# EasyEDA Pro project CH32V307VCT6开源最小系统.eprj, schematic Schematic1
Create Date: 2023-05-18; Page Name: P1; Project Name: CH32V307VCT6最小系统; Schematic Name: Schematic1; Update Date: 2023-06-06; Company: 嘉立创EDA; Page Size: A4; Version: V1.0
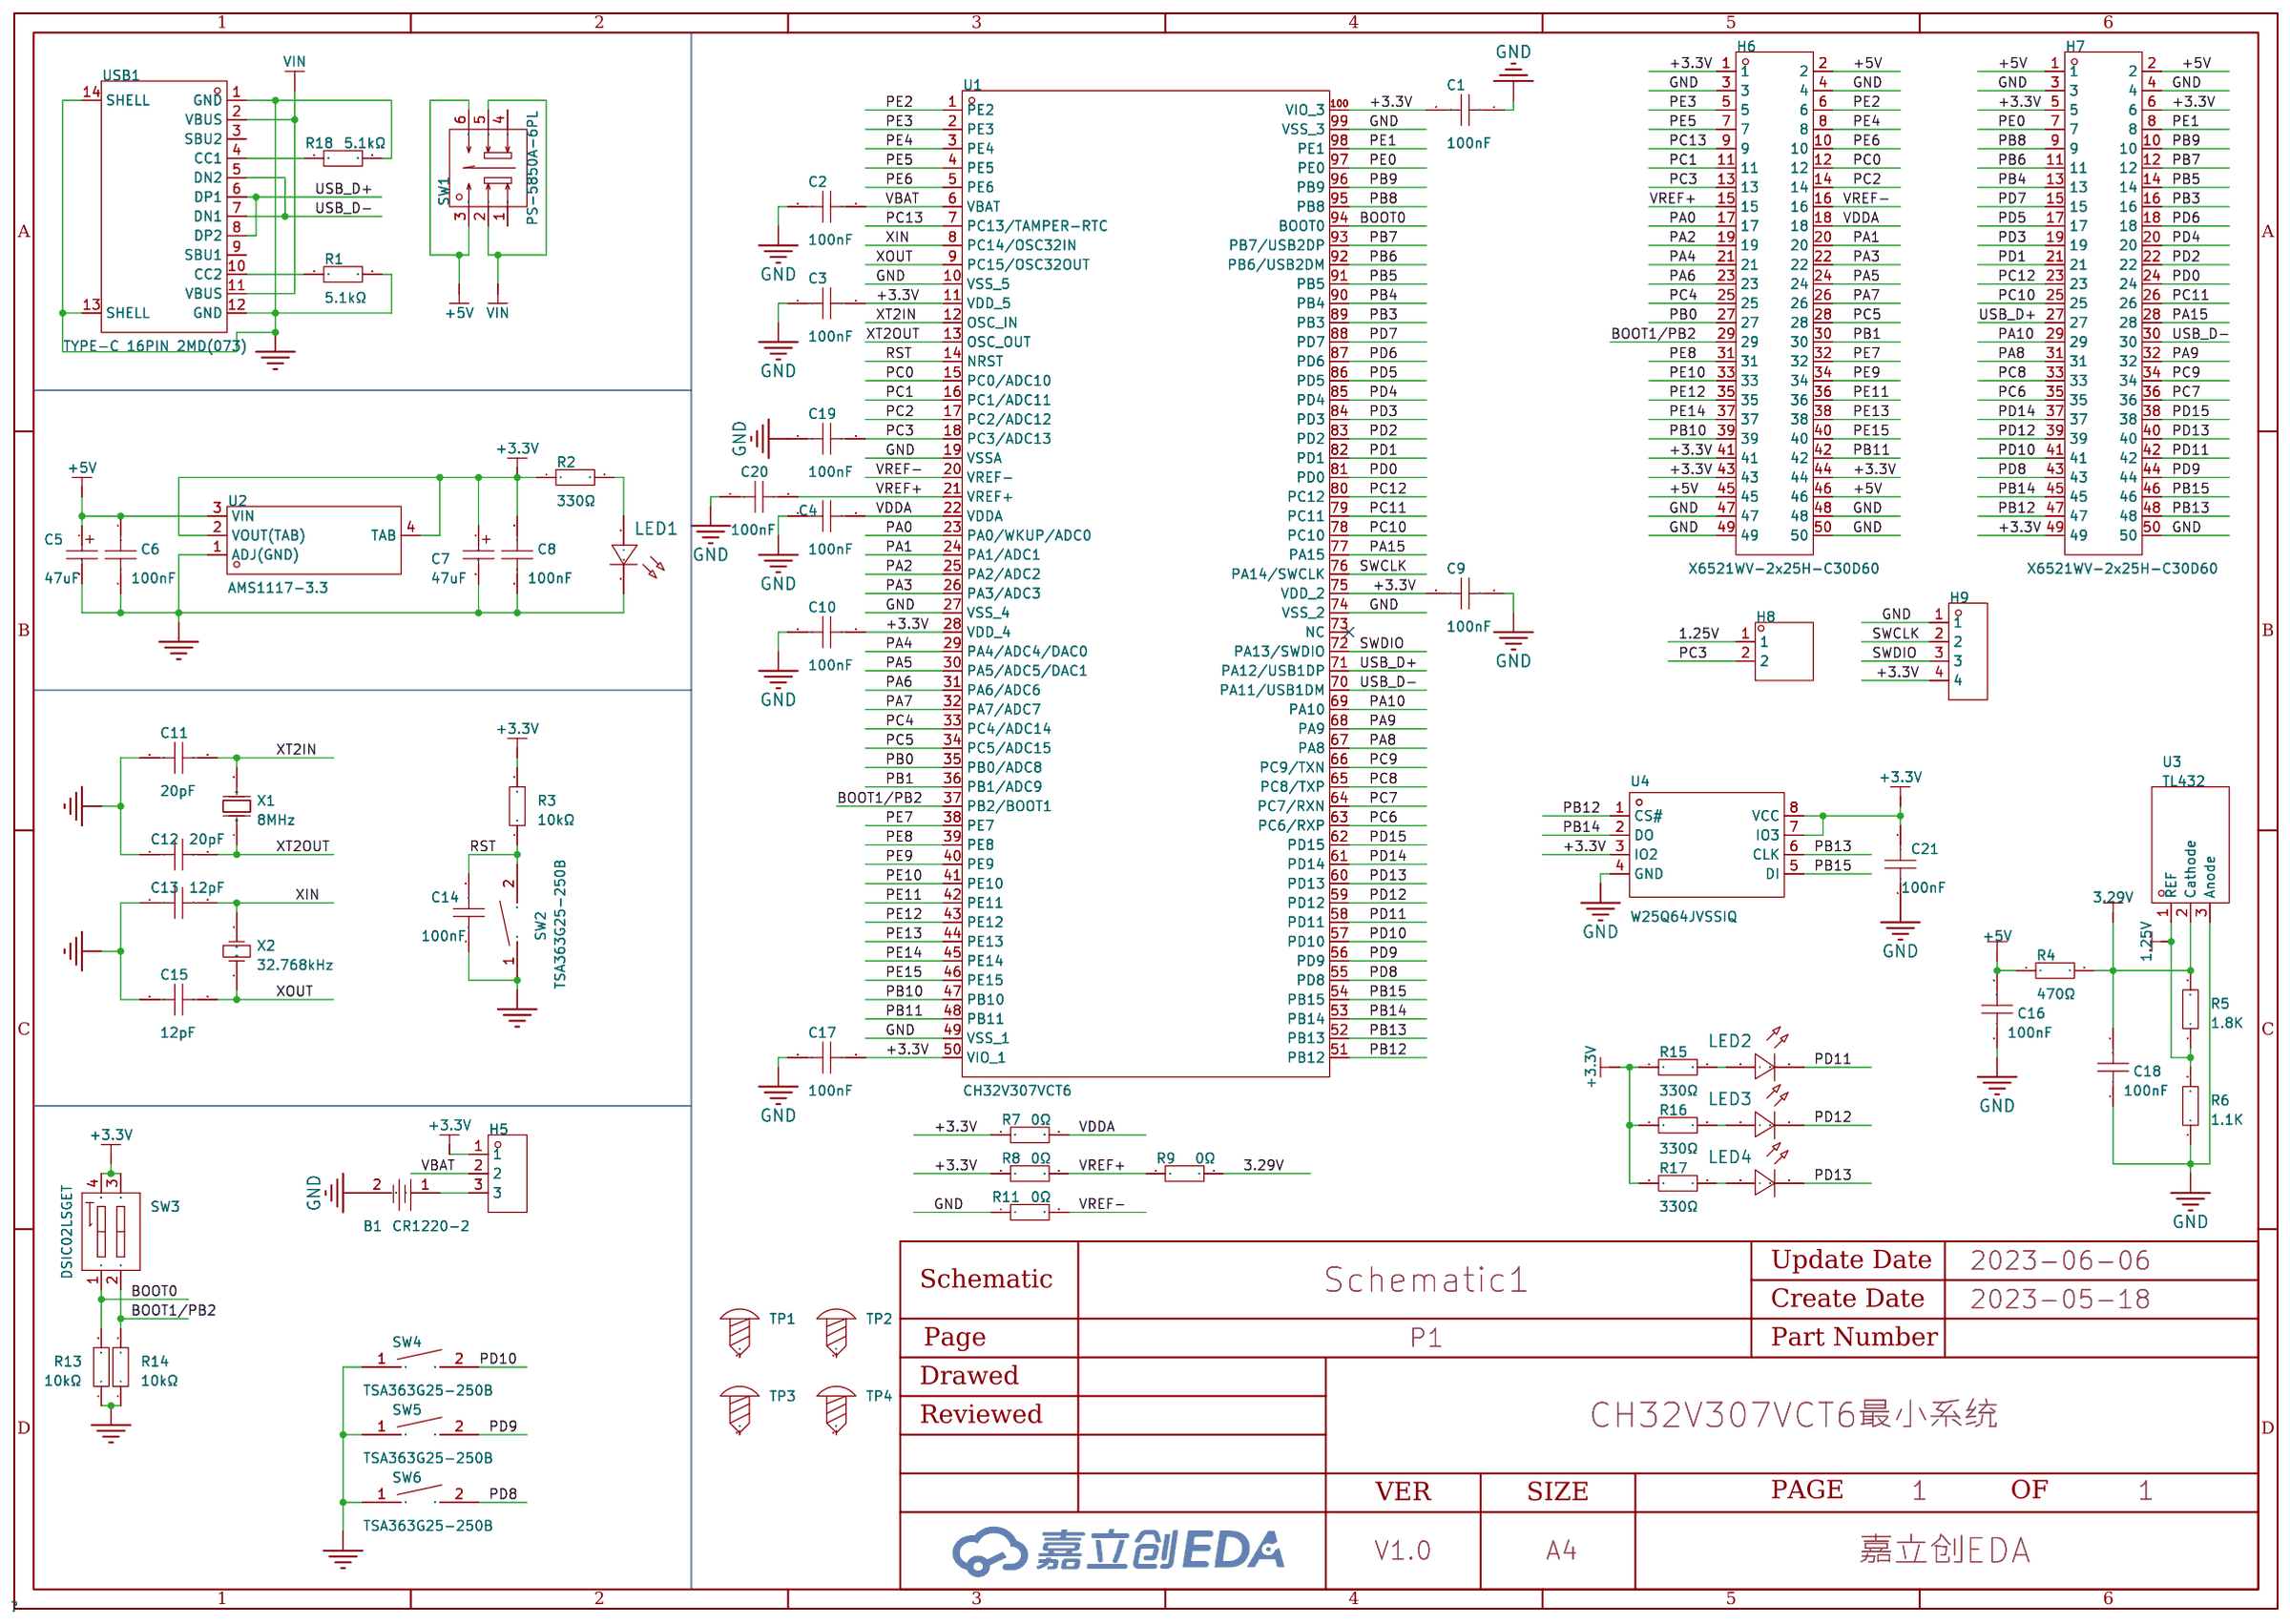
[diagram p0: schematic sheet]

## Parts
B1  CR1220-2  [BAT-SMD_CR1220-2]
C1  100nF  [C0805]
C2  100nF  [C0805]
C3  100nF  [C0805]
C4  100nF  [C0805]
C5  47uF  [CASE-B_3528]
C6  100nF  [C0805]
C7  47uF  [CASE-B_3528]
C8  100nF  [C0805]
C9  100nF  [C0805]
C10  100nF  [C0805]
C11  20pF  [C0805]
C12  20pF  [C0805]
C13  12pF  [C0805]
C14  100nF  [C0805]
C15  12pF  [C0805]
C16  100nF  [C0805]
C17  100nF  [C0805]
C18  100nF  [C0805]
C19  100nF  [C0805]
C20  100nF  [C0805]
C21  100nF  [C0805]
H5  -  [HDR-TH_3P-P2.54-V-M]
H6  X6521WV-2x25H-C30D60  [HDR-TH_50P-2.54-V-M-R2-C25-S2.54]
H7  X6521WV-2x25H-C30D60  [HDR-TH_50P-2.54-V-M-R2-C25-S2.54]
H8  -  [HDR-TH_2P-P2.54-V-M-1]
H9  -  [HDR-TH_4P-P2.54-V-M]
LED1  NCD0805R1  [LED_0805]
LED2  NCD0805R1  [LED_0805]
LED3  NCD0805R1  [LED_0805]
LED4  NCD0805R1  [LED_0805]
R1  5.1kΩ  [R0805]
R2  330Ω  [R0805]
R3  10kΩ  [R0805]
R4  470Ω  [R0805]
R5  1.8K  [R0805]
R6  1.1K  [R0805]
R7  0Ω  [R0805]
R8  0Ω  [R0805]
R9  0Ω  [R0805]
R11  0Ω  [R0805]
R13  10kΩ  [R0805]
R14  10kΩ  [R0805]
R15  330Ω  [R0805]
R16  330Ω  [R0805]
R17  330Ω  [R0805]
R18  5.1kΩ  [R0805]
SW1  PS-5850A-6PL  [SW-TH_6P-L5.8-W5.8-P2.00-LS4.5-BL]
SW2  TSA363G25-250B  [SW-SMD_L6.1-W3.6-LS8.0]
SW3  DSIC02LSGET  [SW-SMD_4P-L6.0-W5.1-P2.54-LS9.3-BL]
SW4  TSA363G25-250B  [SW-SMD_L6.1-W3.6-LS8.0]
SW5  TSA363G25-250B  [SW-SMD_L6.1-W3.6-LS8.0]
SW6  TSA363G25-250B  [SW-SMD_L6.1-W3.6-LS8.0]
TP1  -  [M3螺丝]
TP2  -  [M3螺丝]
TP3  -  [M3螺丝]
TP4  -  [M3螺丝]
U1  CH32V307VCT6  [LQFP-100_L14.0-W14.0-P0.50-LS16.0-BL]
U2  AMS1117-3.3  [SOT-223-4_L6.5-W3.5-P2.30-LS7.0-BR]
U3  TL432  [SOT-23-3_L2.9-W1.3-P1.90-LS2.4-BR]
U4  W25Q64JVSSIQ  [SOP-8_L5.3-W5.3-P1.27-LS8.0-BL]
USB1  TYPE-C 16PIN 2MD(073)  [USB-C-SMD_TYPE-C-6PIN-2MD-073]
X1  8MHz  [CRYSTAL-SMD_L5.0-W3.2]
X2  32.768kHz  [OSC-TH_BD3.1-P0.8-D0.3]

## Library data of the parts
B1 = CR1220-2: 连接器类型:电池底座;适用电池规格:CR1220;工作温度范围:-;; LCSC Part Name: 电池底座 适用电池:CR1220; Supplier Part: C70381; Manufacturer: Q&J; Supplier Footprint: SMD; JLCPCB Part Class: Extended Part; Datasheet: https://atta.szlcsc.com/upload/public/pdf/source/20160427/1461725216696.pdf; Supplier: LCSC; Connector Type: 电池底座; Battery Type: CR1220
C1-C4 C9 C10 C16-C21 = CAP_0805: Supplier Footprint: 0805
C5 C7 = TAJB476K010RNJ: 容值:47uF;精度:±10%;额定电压:10V;等效串联电阻:1Ω@100kHz;工作温度:-55℃~+125℃;; LCSC Part Name: 47uF ±10% 10V; Supplier Part: C22036; Manufacturer: Kyocera AVX; Supplier Footprint: CASE-B-3528; JLCPCB Part Class: Extended Part; Datasheet: https://atta.szlcsc.com/upload/public/pdf/source/20160107/1457707745567.pdf; Supplier: LCSC; Tolerance: ±10%; Rated Voltage: 10V; Equivalent Series Resistance(ESR): 1Ω@100kHz; Operating Temperature: -55℃~+125℃
C6 C8 C14 = CL21B104KBCNNNC: 容值:100nF;精度:±10%;额定电压:50V;材质(温度系数):X7R;; LCSC Part Name: 100nF ±10% 50V; Supplier Part: C1711; Manufacturer: SAMSUNG(三星); Supplier Footprint: 0805; JLCPCB Part Class: Extended Part; Datasheet: https://atta.szlcsc.com/upload/public/pdf/source/20160103/1457707693305.pdf; Supplier: LCSC; Tolerance: ±10%; Voltage Rated: 50V; Temperature Coefficient: X7R
C11 C12 = 0805CG200J500NT: 容值:20pF;精度:±5%;额定电压:50V;材质(温度系数):C0G;; LCSC Part Name: 20pF ±5% 50V; Supplier Part: C94472; Manufacturer: FH(风华); Supplier Footprint: 0805; JLCPCB Part Class: Extended Part; Datasheet: https://atta.szlcsc.com/upload/public/pdf/source/20170923/C94472_1506149578159988997.pdf; Supplier: LCSC; Tolerance: ±5%; Voltage Rated: 50V; Temperature Coefficient: C0G
C13 C15 = 0805CG120J500NT: 容值:12pF;精度:±5%;额定电压:50V;材质(温度系数):C0G;; LCSC Part Name: 12pF ±5% 50V; Supplier Part: C1792; Manufacturer: FH(风华); Supplier Footprint: 0805; JLCPCB Part Class: Basic Part; Datasheet: https://atta.szlcsc.com/upload/public/pdf/source/20170923/C1792_1506149354360988551.pdf; Supplier: LCSC; Tolerance: ±5%; Voltage Rated: 50V; Temperature Coefficient: C0G
H5 = HDR-M_2.54_1x3P: Supplier Part: C2937625; Supplier Footprint: 插件
H6 H7 = X6521WV-2x25H-C30D60: 排数:双排;总PIN位数:50;间距:2.54mm;插针结构:2x25P;行距:2.54mm;安装类型:直插;圆针/方针:方针;额定电流:3A;额定电压:250V;配合针长度:6mm;塑高:2.5mm;端接针长度:3mm;触头材质:黄铜;触头镀层:金;工作温度范围:-40℃~+105℃;焊接温度(最大值):260℃;颜色:黑色;; LCSC Part Name: 2.54mm 2x25P 直插 方针; Supplier Part: C725897; Manufacturer: XKB Connectivity(中国星坤); Supplier Footprint: 插件,P=2.54mm; JLCPCB Part Class: Extended Part; Datasheet: https://atta.szlcsc.com/upload/public/pdf/source/20211009/DE33EBA4104B5B447A7BD8383FBBA145.pdf; Supplier: LCSC; Number of Rows: 双排; Number of Pins: 50; Pitch: 2.54mm; Pin Structure: 2x25P; Row Spacing: 2.54mm; Mounting Type: 直插; Circluar Pins/Square Pins: 方针; Current Rating (Max): 3A; Voltage Rating (Max): 250V; Length of Mating Pin: 6mm; Insulation Height: 2.5mm; Length of End Connection Pin: 3mm; Contact Material: 黄铜; Contact Plating: 金; Operating Temperature Range: -40℃~+105℃; Welding Temperature (Max): 260℃; Color: 黑色
H8 = HDR-M_2.54_1x2P: Supplier Part: C124375; Supplier Footprint: 插件
H9 = HDR-M_2.54_1x4P: Supplier Part: C492403; Supplier Footprint: 插件
LED1-LED4 = NCD0805R1: 发光颜色:红灯;; LCSC Part Name: 红灯; Supplier Part: C84256; Manufacturer: 国星光电; Supplier Footprint: 0805; JLCPCB Part Class: Basic Part; Datasheet: https://atta.szlcsc.com/upload/public/pdf/source/20200820/C84256_F0A75A43B3EAD75808600A0514C76B99.pdf; Supplier: LCSC; Emitted Color: 红灯
R1 R18 = 0805W8F5101T5E: 电阻类型:厚膜电阻;阻值:5.1kΩ;精度:±1%;功率:125mW;; LCSC Part Name: 5.1kΩ ±1% 125mW; Supplier Part: C27834; Manufacturer: UNI-ROYAL(厚声); Supplier Footprint: 0805; JLCPCB Part Class: Basic Part; Datasheet: https://atta.szlcsc.com/upload/public/pdf/source/20200306/C422600_1E6D84923E4A46A82E41ADD87F860B5C.pdf; Supplier: LCSC; Type: 厚膜电阻; Tolerance: ±1%; Power(Watts): 125mW; Temperature Coefficient: ±100ppm/℃; Overload Voltage (Max): 150V; Operating Temperature Range: -55℃~+155℃
R2 R4-R9 R11 R15-R17 = Res_0805: Supplier Footprint: 0805
R3 R13 R14 = 0805W8F1002T5E_C17414: 电阻类型:厚膜电阻;阻值:10kΩ;精度:±1%;功率:125mW;; LCSC Part Name: 10kΩ ±1% 125mW; Supplier Part: C17414; Manufacturer: UNI-ROYAL(厚声); Manufacturer Part: 0805W8F1002T5E; Supplier Footprint: 0805; JLCPCB Part Class: Basic Part; Datasheet: https://atta.szlcsc.com/upload/public/pdf/source/20200306/C422600_1E6D84923E4A46A82E41ADD87F860B5C.pdf; Supplier: LCSC; Type: 厚膜电阻; Tolerance: ±1%; Power(Watts): 125mW; Temperature Coefficient: ±100ppm/℃; Overload Voltage (Max): 150V; Operating Temperature Range: -55℃~+155℃
SW1 = PS-5850A-6PL: 5.8自锁按键开关 高头 耐高温; LCSC Part Name: 自锁按键开关; Supplier Part: C963201; Manufacturer: G-Switch(品赞); Supplier Footprint: 插件,5.8x5.8x10mm; JLCPCB Part Class: Extended Part; Datasheet: https://atta.szlcsc.com/upload/public/pdf/source/20201201/C963201_9229C247AC907A82E381B4EE0BC1DEDE.pdf; Supplier: LCSC
SW2 SW4-SW6 = TSA363G25-250B: 触点电流:50mA;额定电压(DC):12V;电路结构:单刀单掷;按钮作用方向:顶部触动;致动器样式:矩形按钮;照明颜色:-;开关长度:6.05mm;开关宽度:3.6mm;开关高度:2.5mm;; LCSC Part Name: 3*6*2.5  白柄贴片  250gf; Supplier Part: C354943; Manufacturer: BRIGHT(博瑞泰); Supplier Footprint: SMD; JLCPCB Part Class: Extended Part; Datasheet: https://atta.szlcsc.com/upload/public/pdf/source/20190426/C354943_F8D02988919B0D3B4D493E3C3D798834.pdf; Supplier: LCSC; Contact Current: 50mA; Voltage Rating (DC): 12V; Circuit: 单刀单掷; Actuator Orientation: 顶部触动; Actuator Style: 矩形按钮; Switch Length: 6.05mm; Switch Width: 3.6mm; Switch Height: 2.5mm
SW3 = DSIC02LSGET: 类型:平拨，凸起式;电路结构:单刀单掷;开关位数:2;引脚间距:2.54mm;颜色:黑色;; LCSC Part Name: 2.54mm 2位高推 拨码开关; Supplier Part: C54949; Manufacturer: YE; Supplier Footprint: SMD-4P,6x5.08mm; JLCPCB Part Class: Extended Part; Datasheet: https://atta.szlcsc.com/upload/public/pdf/source/20150928/1457707425489.pdf; Supplier: LCSC; Type: 平拨，凸起式; Circuit: 单刀单掷; Number of Positions: 2; Lead Pitch: 2.54mm; Color: 黑色
TP1-TP4 = M3螺丝: Supplier Footprint: 插件
U1 = CH32V307VCT6: CPU内核:RISC-V;CPU最大主频:144MHz;工作电压范围:2.5V~3.3V;内部振荡器:有;外部时钟频率范围:3MHz~25MHz;程序 FLASH容量:256KB;RAM总容量:64KB;EEPROM/数据 FLASH容量:-;GPIO端口数量:80;ADC(单元数/通道数/位数):2@x16ch/12bit;DAC(单元数/通道数/位数):2@x2ch/12bit;(E)PWM(单元数/通道数/位数):8@x32ch/16bit;8位Timer数量:-;16位Timer数量:10;32位; LCSC Part Name: RISC-V 144MHz 闪存：256KB RAM：64KB; Supplier Part: C2943979; Manufacturer: WCH(南京沁恒); Supplier Footprint: LQFP-100(14x14); JLCPCB Part Class: Extended Part; Datasheet: https://atta.szlcsc.com/upload/public/pdf/source/20220111/249074F152243A2E6E0364BFD3BF5289.pdf; Supplier: LCSC; CPU Core: RISC-V; Maximum Frequency: 144MHz; Supply Voltage Range: 2.5V~3.3V; Internal Oscillator: 有; External Clock Frequency Rang: 3MHz~25MHz; Program FLASH Size: 256KB; RAM Size: 64KB; GPIO Ports Number: 80; ADC (Units/Channels/bits): 2@x16ch/12bit; DAC (Units/Channels/bits): 2@x2ch/12bit; (E)PWM (Units/Channels/bits): 8@x32ch/16bit; 16Bit Timer Number: 10; CMP Number: 4; U(S)ART Number: 8; I2C Number: 2; I2S Number: 2; (Q)SPI Number: 3; CAN Number: 2; Operating Temperature Range: -40℃~+85℃
U2 = AMS1117-3.3_C347222: 输出类型:固定;输出极性:正;输出通道数:1;最大输入电压:18V;输出电压:3.3V;压差:1.3V@(1A);输出电流:1A;电源纹波抑制比(PSRR):60dB@(120Hz);; LCSC Part Name: 正 Vin=18V Vout=3.3V 1A 60dB@(120Hz); Supplier Part: C347222; Manufacturer: UMW(广东友台半导体); Supplier Footprint: SOT-223-4; JLCPCB Part Class: Extended Part; Datasheet: https://atta.szlcsc.com/upload/public/pdf/source/20211011/50CC665C22E3A66C08379A4A74BDA25C.pdf; Supplier: LCSC; Output Type: 固定; Output Polarity: 正; Number of Outputs: 1; Maximum Input Voltage: 18V; Output Voltage: 3.3V; Dropout Voltage: 1.3V@(1A); Output Current: 1A; Power Supply Rejection Ratio (PSRR): 60dB@(120Hz)
U3 = TL432_C5184435: 电压基准类型:-;输出类型:可调;输入电压:-;输出电压:1.25V~18V;输出电流:100mA;精度:±1%;温度系数:-;静态电流:-;最小阴极电流调节:-;噪声(0.1Hz-10Hz):-;噪声(10Hz-10kHz):-;动态阻抗:-;工作温度:0℃~+70℃@(Ta);; LCSC Part Name: 1.25V~18V 100mA; Supplier Part: C5184435; Manufacturer: HXY MOSFET(华轩阳电子); Supplier Footprint: SOT-23; Datasheet: https://atta.szlcsc.com/upload/public/pdf/source/20220926/BC9BA250DBB97364FC1F59E1FEEBCD78.pdf; Supplier: LCSC; Output Type: 可调; Output Voltage: 1.25V~18V; Output Current: 100mA; Tolerance: ±1%; Operating Temperature: 0℃~+70℃@(Ta)
U4 = W25Q64JVSSIQ_C83140: 64M-bit/8M-byte FLASH芯片,SPI接口 133MHz(266/532MHz Dual/Quad-SPI) 比W25Q64FVSSIG更高速度; Supplier Part: C83140; Manufacturer: WINBOND(华邦); Supplier Footprint: SOP-8-208mil; JLCPCB Part Class: Extended Part; Datasheet: https://atta.szlcsc.com/upload/public/pdf/source/20161110/1478742546019.pdf; Supplier: LCSC
USB1 = TYPE-C 16PIN 2MD(073): 连接器类型:Type-C;标准:-;公母:母座;触点数量:16;端口数量:1;安装方式:卧贴;额定电流 - 电源:5A;工作温度范围:-25℃~+85℃;; LCSC Part Name: TYPE-C母座 16P 4脚插件带定位柱 不锈钢外壳 2次模顶; Supplier Part: C2765186; Manufacturer: SHOU HAN(首韩); Supplier Footprint: SMD; JLCPCB Part Class: Extended Part; Datasheet: https://atta.szlcsc.com/upload/public/pdf/source/20211123/39B17C16241EAC15C5E277BDA434118E.pdf; Supplier: LCSC; Connector Type: Type-C; Gender: 母座; Number of Contacts: 16; Number of Ports: 1; Mounting Style: 卧贴; Current Rating - Power (Max): 5A; Operating Temperature Range: -25℃~+85℃
X1 = X50328MSB2GI: 频率:8MHz;频率公差:±10ppm;负载电容:20pF;; LCSC Part Name: 8MHz ±10ppm 20pF YSX530GA; Supplier Part: C115962; Manufacturer: YXC(扬兴晶振); Supplier Footprint: SMD5032-2P; JLCPCB Part Class: Basic Part; Datasheet: https://atta.szlcsc.com/upload/public/pdf/source/20230220/0EBFFB9D6D8CE6A211407822BBB6C516.pdf; Supplier: LCSC; Crystal Type: 贴片无源晶振; Frequency Tolerance: ±10ppm; Frequency Stability: ±50ppm; Load Capacitance: 20pF; Operating Temperature: -40℃~+85℃
X2 = X308032768KGB2SC: 频率:32.768kHz;频率公差:±10ppm;负载电容:12.5pF;; LCSC Part Name: 32.768kHz ±10ppm 12.5pF YT-38; Supplier Part: C52082; Manufacturer: YXC(扬兴晶振); Supplier Footprint: DT-38; JLCPCB Part Class: Extended Part; Datasheet: https://atta.szlcsc.com/upload/public/pdf/source/20210729/394323D37097DADF5DA3ECA9C1DCF4BF.pdf; Supplier: LCSC; Crystal Type: 圆柱体晶振; Frequency Tolerance: ±10ppm; Load Capacitance: 12.5pF; Operating Temperature: -20℃~+70℃

## Nets
1.25V: H8.1 R5.1 R6.2 U3.1(REF)
3.29V: C18.2 R4.2 R5.2 R9.2 U3.2(Cathode)
+3.3V: C1.2 C3.2 C7.1 C8.2 C9.2 C10.2 C17.2 C21.2 H5.1 H6.1 H6.41 H6.43 H6.44 H7.5 H7.6 H7.49 H9.4 R2.1 R3.2 R7.1 R8.1 R15.1 R16.1 R17.1 SW3.3(B2) SW3.4(B1) U1.11(VDD_5) U1.28(VDD_4) U1.50(VIO_1) U1.75(VDD_2) U1.100(VIO_3) U2.2(VOUT(TAB)) U2.4(TAB) U4.3(IO2) U4.7(IO3) U4.8(VCC)
+5V: C5.1 C6.2 C16.2 H6.2 H6.45 H6.46 H7.1 H7.2 R4.1 SW1.3 SW1.6 U2.3(VIN)
GND: B1.2 C1.1 C2.1 C3.1 C4.1 C5.2 C6.1 C7.2 C8.1 C9.1 C10.1 C11.1 C12.1 C13.1 C14.1 C15.1 C16.1 C17.1 C18.1 C19.1 C20.1 C21.1 H6.3 H6.4 H6.47 H6.48 H6.49 H6.50 H7.3 H7.4 H7.50 H9.1 LED1.1(C) R1.2 R6.1 R11.1 R13.1 R14.1 R18.2 SW2.1 SW4.1 SW5.1 SW6.1 U1.10(VSS_5) U1.19(VSSA) U1.27(VSS_4) U1.49(VSS_1) U1.74(VSS_2) U1.99(VSS_3) U2.1(ADJ(GND)) U3.3(Anode) U4.4(GND) USB1.1(GND) USB1.12(GND) USB1.13(SHELL) USB1.14(SHELL)
VBAT: C2.2 H5.2 U1.6(VBAT)
VDDA: C4.2 H6.18 R7.2 U1.22(VDDA)
VIN: SW1.2 SW1.5 USB1.2(VBUS) USB1.11(VBUS)
BOOT0: R13.2 SW3.1(A1) U1.94(BOOT0)
BOOT1/PB2: H6.29 R14.2 SW3.2(A2) U1.37(PB2/BOOT1)
PA0: H6.17 U1.23(PA0/WKUP/ADC0)
PA1: H6.20 U1.24(PA1/ADC1)
PA2: H6.19 U1.25(PA2/ADC2)
PA3: H6.22 U1.26(PA3/ADC3)
PA4: H6.21 U1.29(PA4/ADC4/DAC0)
PA5: H6.24 U1.30(PA5/ADC5/DAC1)
PA6: H6.23 U1.31(PA6/ADC6)
PA7: H6.26 U1.32(PA7/ADC7)
PA8: H7.31 U1.67(PA8)
PA9: H7.32 U1.68(PA9)
PA10: H7.29 U1.69(PA10)
PA15: H7.28 U1.77(PA15)
PB0: H6.27 U1.35(PB0/ADC8)
PB1: H6.30 U1.36(PB1/ADC9)
PB3: H7.16 U1.89(PB3)
PB4: H7.13 U1.90(PB4)
PB5: H7.14 U1.91(PB5)
PB6: H7.11 U1.92(PB6/USB2DM)
PB7: H7.12 U1.93(PB7/USB2DP)
PB8: H7.9 U1.95(PB8)
PB9: H7.10 U1.96(PB9)
PB10: H6.39 U1.47(PB10)
PB11: H6.42 U1.48(PB11)
PB12: H7.47 U1.51(PB12) U4.1(CS#)
PB13: H7.48 U1.52(PB13) U4.6(CLK)
PB14: H7.45 U1.53(PB14) U4.2(DO)
PB15: H7.46 U1.54(PB15) U4.5(DI)
PC0: H6.12 U1.15(PC0/ADC10)
PC1: H6.11 U1.16(PC1/ADC11)
PC2: H6.14 U1.17(PC2/ADC12)
PC3: C19.2 H6.13 H8.2 U1.18(PC3/ADC13)
PC4: H6.25 U1.33(PC4/ADC14)
PC5: H6.28 U1.34(PC5/ADC15)
PC6: H7.35 U1.63(PC6/RXP)
PC7: H7.36 U1.64(PC7/RXN)
PC8: H7.33 U1.65(PC8/TXP)
PC9: H7.34 U1.66(PC9/TXN)
PC10: H7.25 U1.78(PC10)
PC11: H7.26 U1.79(PC11)
PC12: H7.23 U1.80(PC12)
PC13: H6.9 U1.7(PC13/TAMPER-RTC)
PD0: H7.24 U1.81(PD0)
PD1: H7.21 U1.82(PD1)
PD2: H7.22 U1.83(PD2)
PD3: H7.19 U1.84(PD3)
PD4: H7.20 U1.85(PD4)
PD5: H7.17 U1.86(PD5)
PD6: H7.18 U1.87(PD6)
PD7: H7.15 U1.88(PD7)
PD8: H7.43 SW6.2 U1.55(PD8)
PD9: H7.44 SW5.2 U1.56(PD9)
PD10: H7.41 SW4.2 U1.57(PD10)
PD11: H7.42 LED2.1(C) U1.58(PD11)
PD12: H7.39 LED3.1(C) U1.59(PD12)
PD13: H7.40 LED4.1(C) U1.60(PD13)
PD14: H7.37 U1.61(PD14)
PD15: H7.38 U1.62(PD15)
PE0: H7.7 U1.97(PE0)
PE1: H7.8 U1.98(PE1)
PE2: H6.6 U1.1(PE2)
PE3: H6.5 U1.2(PE3)
PE4: H6.8 U1.3(PE4)
PE5: H6.7 U1.4(PE5)
PE6: H6.10 U1.5(PE6)
PE7: H6.32 U1.38(PE7)
PE8: H6.31 U1.39(PE8)
PE9: H6.34 U1.40(PE9)
PE10: H6.33 U1.41(PE10)
PE11: H6.36 U1.42(PE11)
PE12: H6.35 U1.43(PE12)
PE13: H6.38 U1.44(PE13)
PE14: H6.37 U1.45(PE14)
PE15: H6.40 U1.46(PE15)
RST: C14.2 R3.1 SW2.2 U1.14(NRST)
SWCLK: H9.2 U1.76(PA14/SWCLK)
SWDIO: H9.3 U1.72(PA13/SWDIO)
USB_D+: H7.27 U1.71(PA12/USB1DP) USB1.6(DP1) USB1.8(DP2)
USB_D-: H7.30 U1.70(PA11/USB1DM) USB1.5(DN2) USB1.7(DN1)
VREF+: C20.2 H6.15 R8.2 R9.1 U1.21(VREF+)
VREF-: H6.16 R11.2 U1.20(VREF-)
XIN: C13.2 U1.8(PC14/OSC32IN) X2.1(OSC1)
XOUT: C15.2 U1.9(PC15/OSC32OUT) X2.2(OSC2)
XT2IN: C11.2 U1.12(OSC_IN) X1.2(OSC2)
XT2OUT: C12.2 U1.13(OSC_OUT) X1.1(OSC1)
$1N1179: LED1.2(A) R2.2
$1N8998: B1.1 H5.3
$1N11842: LED2.2(A) R15.2
$1N11913: LED3.2(A) R16.2
$1N11966: LED4.2(A) R17.2
$1N16330: R1.1 USB1.10(CC2)
$1N16369: R18.1 USB1.4(CC1)

Not connected (* = marked no-connect by the designer): SW1 1 4; TP1 1; TP2 1; TP3 1; TP4 1; U1 73(NC)*; USB1 3(SBU2) 9(SBU1)
